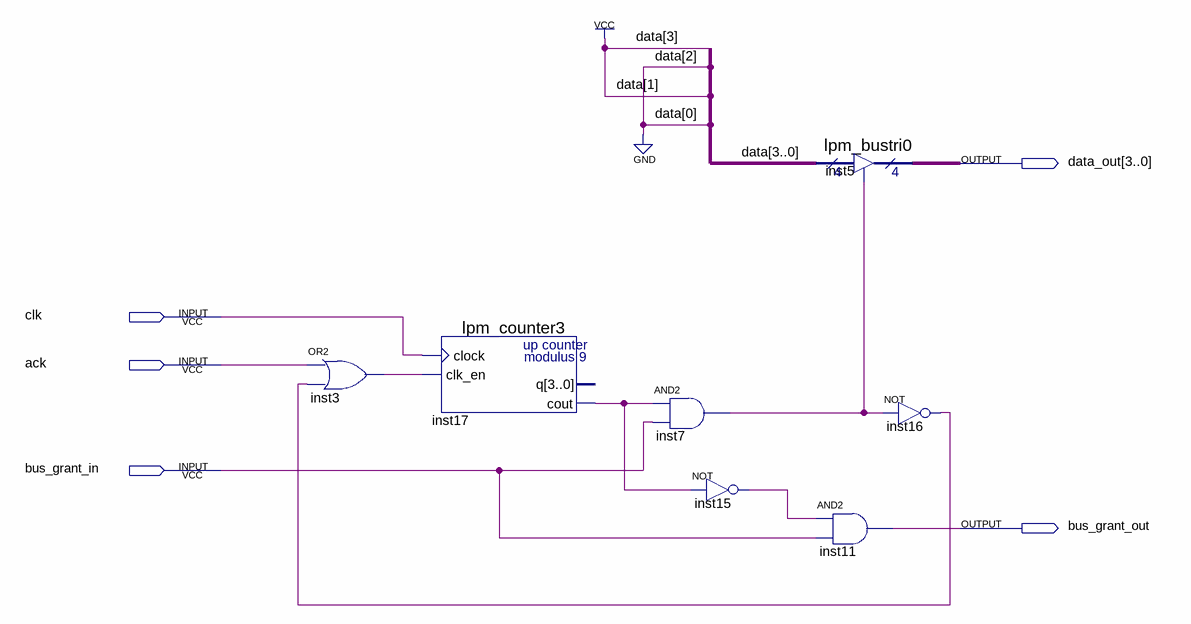
[diagram p0: schematic sheet]
// Quartus schematic master_block_4.bdf as structural Verilog: 7 symbols, 5 pins
module master_block_4 (
  input  clk,
  input  ack,
  input  bus_grant_in,
  output [3:0] data_out,
  output bus_grant_out
);

  wire inst3_out, inst7_out, inst15_out, inst16_out, inst17_cout;

  or inst3 (inst3_out, ack, inst16_out);
  lpm_counter3 inst17 (.clock(clk), .clk_en(inst3_out), .cout(inst17_cout));  // open: q
  and inst7 (inst7_out, inst17_cout, bus_grant_in);
  not inst15 (inst15_out, inst17_cout);
  lpm_bustri0 inst5 (.enabledt(inst7_out), .data(4'b1010), .tridata(data_out));
  and inst11 (bus_grant_out, inst15_out, bus_grant_in);
  not inst16 (inst16_out, inst7_out);
endmodule
